# Altium project System 24 UPU.PrjPcb (part 1 of 3)
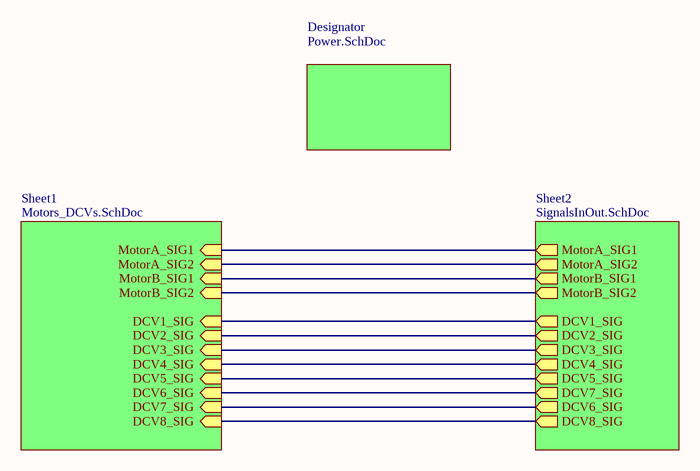
[diagram p0: UPU.SchDoc]
4 sheets, 125 parts. Net scope: hierarchical (ports join the sheet entries above them; power ports are global).
Board file: UPU24.PcbDoc
Sheets:
  UPU.SchDoc
    Designator = Power.SchDoc
    Sheet1 = Motors_DCVs.SchDoc
    Sheet2 = SignalsInOut.SchDoc

## Sheet UPU.SchDoc
size OrCAD A; SheetNumber: 1; SheetTotal: 4

### Sub-sheets
Designator = Power.SchDoc: no entries
Sheet1 = Motors_DCVs.SchDoc: MotorA_SIG1 (in), MotorA_SIG2 (in), MotorB_SIG1 (in), MotorB_SIG2 (in), DCV1_SIG (in), DCV2_SIG (in), DCV3_SIG (in), DCV4_SIG (in), DCV5_SIG (in), DCV6_SIG (in), DCV7_SIG (in), DCV8_SIG (in)
Sheet2 = SignalsInOut.SchDoc: DCV1_SIG (out), DCV2_SIG (out), DCV3_SIG (out), DCV4_SIG (out), DCV5_SIG (out), DCV7_SIG (out), DCV6_SIG (out), DCV8_SIG (out), MotorA_SIG1 (out), MotorA_SIG2 (out), MotorB_SIG1 (out), MotorB_SIG2 (out)

### Nets
DCV1_SIG: sheet Sheet1/DCV1_SIG, sheet Sheet2/DCV1_SIG
DCV2_SIG: sheet Sheet1/DCV2_SIG, sheet Sheet2/DCV2_SIG
DCV3_SIG: sheet Sheet1/DCV3_SIG, sheet Sheet2/DCV3_SIG
DCV4_SIG: sheet Sheet1/DCV4_SIG, sheet Sheet2/DCV4_SIG
DCV5_SIG: sheet Sheet1/DCV5_SIG, sheet Sheet2/DCV5_SIG
DCV6_SIG: sheet Sheet1/DCV6_SIG, sheet Sheet2/DCV7_SIG
DCV7_SIG: sheet Sheet1/DCV7_SIG, sheet Sheet2/DCV6_SIG
DCV8_SIG: sheet Sheet1/DCV8_SIG, sheet Sheet2/DCV8_SIG
MotorA_SIG1: sheet Sheet1/MotorA_SIG1, sheet Sheet2/MotorA_SIG1
MotorA_SIG2: sheet Sheet1/MotorA_SIG2, sheet Sheet2/MotorA_SIG2
MotorB_SIG1: sheet Sheet1/MotorB_SIG1, sheet Sheet2/MotorB_SIG1
MotorB_SIG2: sheet Sheet1/MotorB_SIG2, sheet Sheet2/MotorB_SIG2